# EAGLE design senseBox-OLED_v21 (EAGLE 7.7.0)
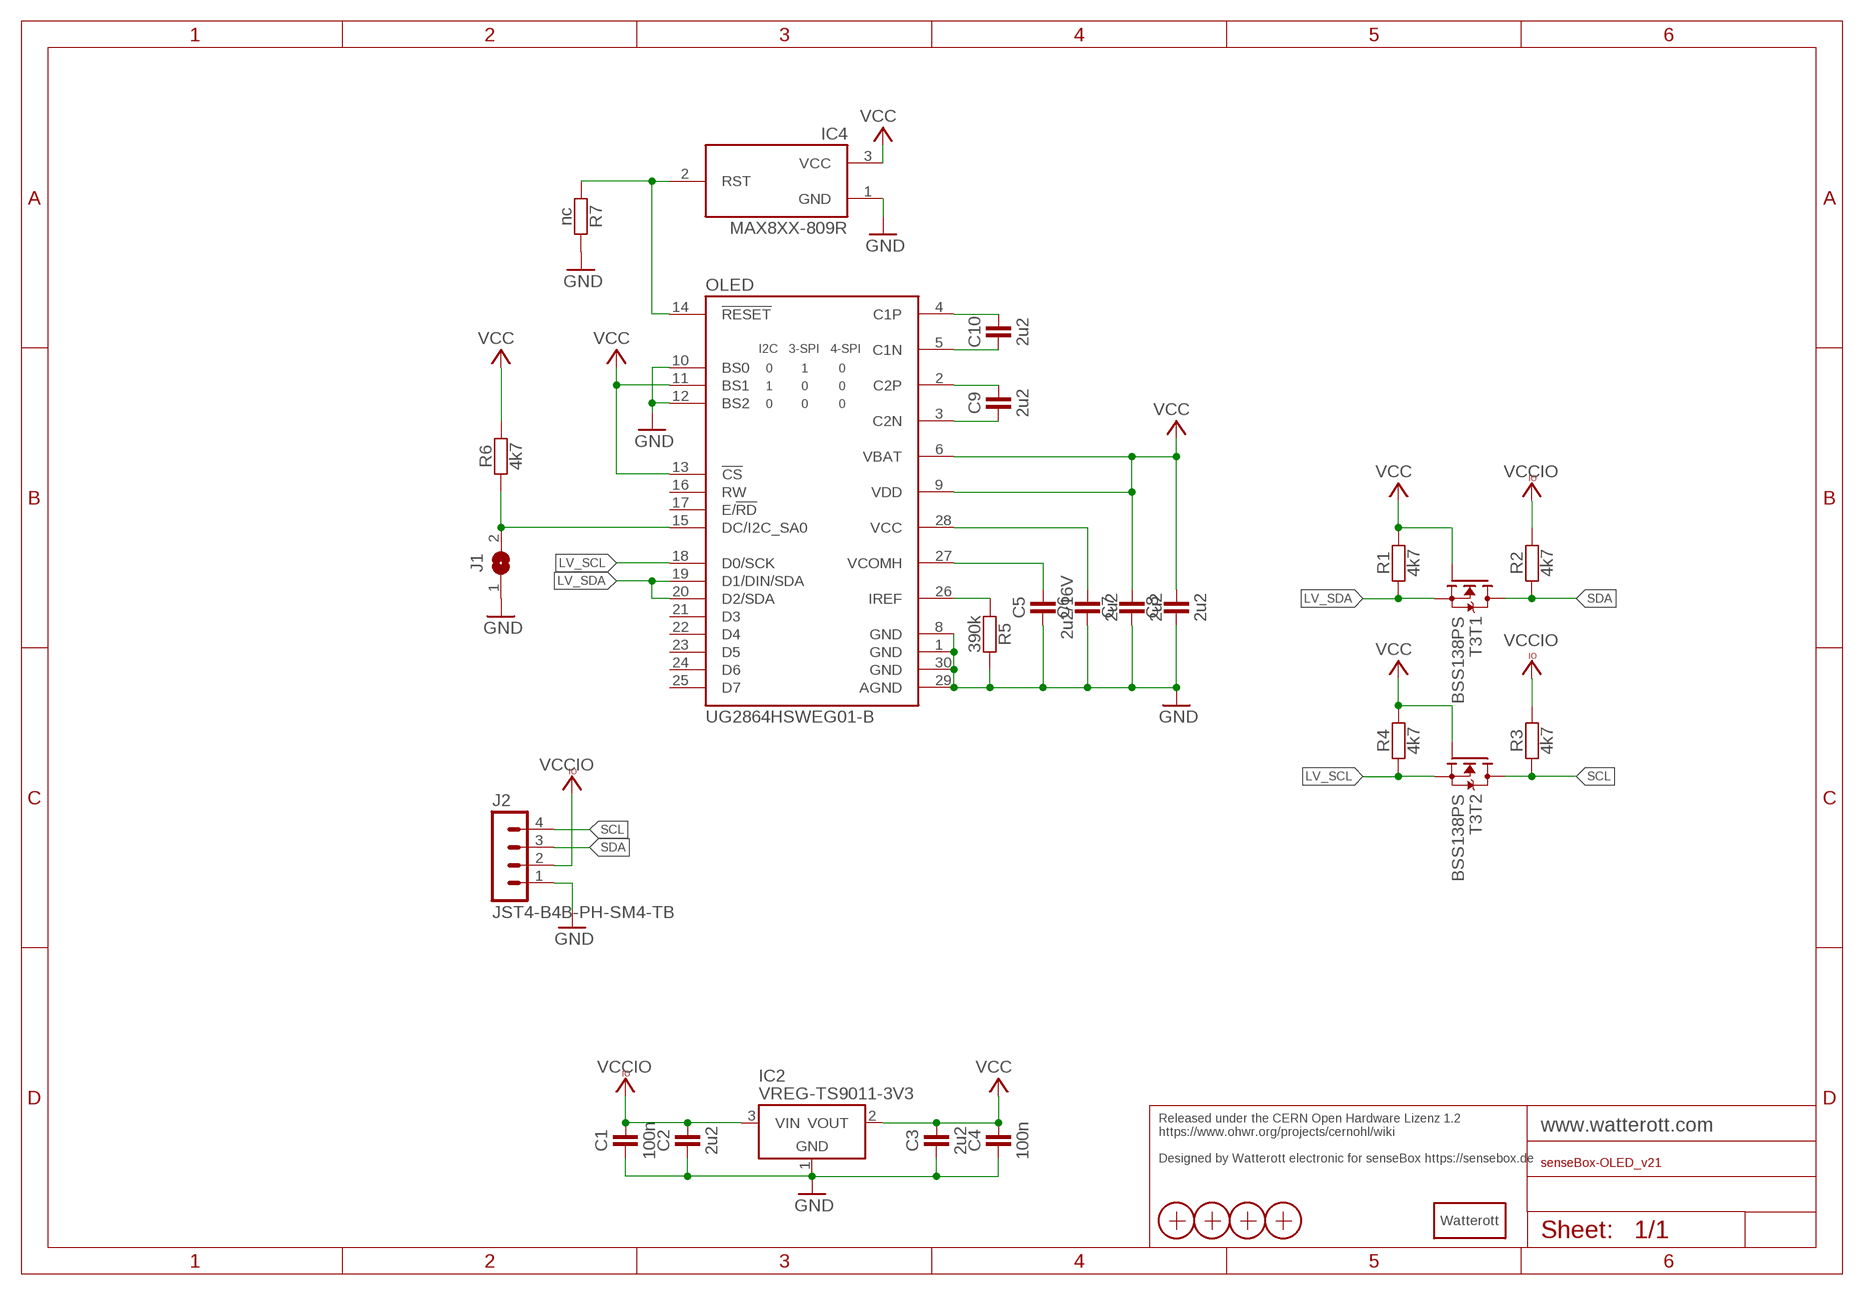
[diagram p0: schematic, sheet 1]

## Parts
C1  100n  CAPACITOR-0402  [C0402]
C2  2u2  CAPACITOR-0402  [C0402]
C3  2u2  CAPACITOR-0402  [C0402]
C4  100n  CAPACITOR-0402  [C0402]
C5  2u2/16V  CAPACITOR-0402  [C0402]
C6  2u2  CAPACITOR-0402  [C0402]
C7  2u2  CAPACITOR-0402  [C0402]
C8  2u2  CAPACITOR-0402  [C0402]
C9  2u2  CAPACITOR-0402  [C0402]
C10  2u2  CAPACITOR-0402  [C0402]
IC2  VREG-TS9011-3V3  [SOT23]
IC4  MAX8XX-809R  [SOT23]
J1  JUMPER2-0402-NC  [JUMPER2-0402_NC]
J2  JST4-B4B-PH-SM4-TB  [JST_B4B-PH-SM4-TB]
LOGO1  LOGO_SPARK-2  [SPARK_2MM]
OLED  UG2864HSWEG01-B  [UG2864HSWEG01_BOT]
R1  4k7  RESISTOR-0402  [C0402]
R2  4k7  RESISTOR-0402  [C0402]
R3  4k7  RESISTOR-0402  [C0402]
R4  4k7  RESISTOR-0402  [C0402]
R5  390k  RESISTOR-0402  [C0402]
R6  4k7  RESISTOR-0402  [C0402]
R7  nc  RESISTOR-0402  [C0402]
T3  BSS138PS  [SOT363]
X1  PASSER-07  [PASSER_07MM]
X2  PASSER-07  [PASSER_07MM]
X3  PASSER-07  [PASSER_07MM]
X4  PASSER-07  [PASSER_07MM]

## Nets
C1N: C10.1 OLED.5(C1N)
C1P: C10.2 OLED.4(C1P)
C2N: C9.1 OLED.3(C2N)
C2P: C9.2 OLED.2(C2P)
GND: C1.1 C2.1 C3.1 C4.1 C5.1 C6.1 C7.1 C8.1 IC2.1(GND) IC4.1(GND) J1.1 J2.1 OLED.1(GND) OLED.8(GND) OLED.10(BS0) OLED.12(BS2) OLED.29(AGND) OLED.30(GND) R5.2 R7.2
IREF: OLED.26(IREF) R5.1
LV_SCL: OLED.18(D0/SCK) R4.1 T3.4(T2:S)
LV_SDA: OLED.19(D1/DIN/SDA) OLED.20(D2/SDA) R1.1 T3.1(T1:S)
RST: IC4.2(RST) OLED.14(!RESET) R7.1
SA0: J1.2 OLED.15(DC/I2C_SA0) R6.1
SCL: J2.4 R3.1 T3.3(T2:D)
SDA: J2.3 R2.1 T3.6(T1:D)
VC: C6.2 OLED.28(VCC)
VCC: C3.2 C4.2 C7.2 C8.2 IC2.2(VOUT) IC4.3(VCC) OLED.6(VBAT) OLED.9(VDD) OLED.11(BS1) OLED.13(!CS) R1.2 R4.2 R6.2 T3.2(T1:G) T3.5(T2:G)
VCCIO: C1.2 C2.2 IC2.3(VIN) J2.2 R2.2 R3.2
VCH: C5.2 OLED.27(VCOMH)
Unconnected: OLED.16(RW) OLED.17(E/!RD) OLED.21(D3) OLED.22(D4) OLED.23(D5) OLED.24(D6) OLED.25(D7)

## Notes on the sheet
- Released under the CERN Open Hardware Lizenz 1.2
  https://www.ohwr.org/projects/cernohl/wiki
  
  Designed by Watterott electronic for senseBox https://sensebox.de

## Library data of the parts
C1-C10 = we-rcl:CAPACITOR: Capacitors ...2.2uF @ 6.3V -> 0402 ...4.7uF @ 6.3V -> 0603 ...10uF @ 16V -> 0805 ...22uF @ 25V -> 1206
IC2 = we-power:VREG: Voltage Regulators (LDOs, Switching Converters...) LDOs Taiwan Semi TS1117 800mA max 15V - compatible On Semi NCP1117 1A max 20V - compatible Diodes AP2111H 0.6A max 6V (0.25V@0.6A) - compatible Diodes AP2114H 1A max 6V (0.45V@1A) Taiwan Semi TS9011 250mA max 12V - compatible Diodes AP2210 300mA max 15V - compatible Microchip MCP1700 250mA max 6.5V - compatible Microchip MCP1702 250mA max 13V - compatible Microchip MCP1703 250mA max 16V - compatible Microchip MCP1754 150mA max 16V Taiwan Semi TS5204 80mA max 16V (low noise) DC/DC Converter Modules Recom R-78Ex.x-1.0-W36 1A max 28V - compatible CUI V78xx-2000 2A max 18V Murata OKI-78SR-x.x/1.5-W36 1.5A max 36V
IC4 = we-chip:MAX8XX: MAX8xx / STM8xx / TCM8xx Reset Monitor Reset Time: mind. 140ms, typ. 320ms, max. 560ms 803 - Active-Low, Open-Drain 809 - Active-Low, Push-Pull 810 - Active-High, Push-Pull ...Z - 2.3V ...R - 2.6V ...S - 2.9V ...T - 3.1V ...J - 4.0V ...M - 4.4V ...L - 4.6V
J1 = we-rcl:JUMPER2: 2 Pin Jumpers
J2 = we-con:JST4: JST Connector
LOGO1 = we-symbol:LOGO_SPARK: Watterott electronic Logo
OLED = we-opto:UG2864HSWEG01: Univision/WiseChip UG-2864HSWEG01 0.9" OLED (128x64) with SSD1306
R1-R7 = we-rcl:RESISTOR: Resistors all kinds in 0402 and 0603
T3 = we-transistor:BSS138PS: Dual N-Channel MOSFET BSS138 (Vgs>=+/-20V, Vds>=40V, Id>=0.2A + Rds<=3Ohm @ Vgs=4.5V)
X1-X4 = we-symbol:PASSER: Fiducial Markers

## Board
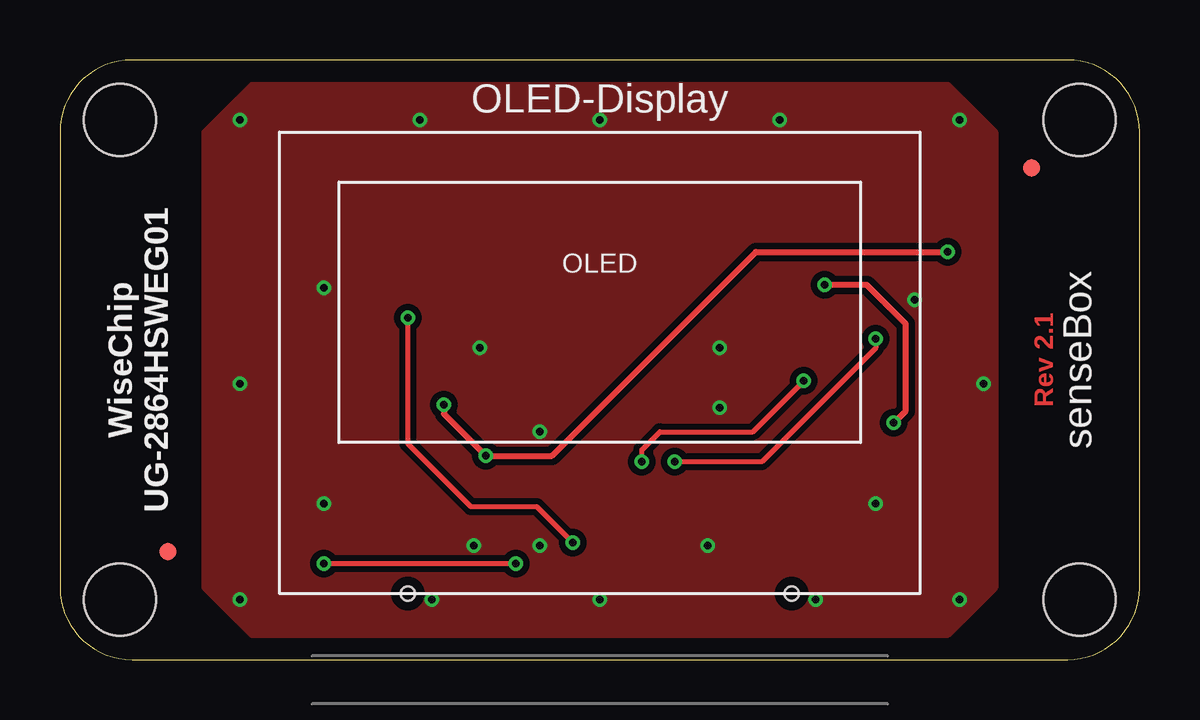
[diagram p1: board, top side]
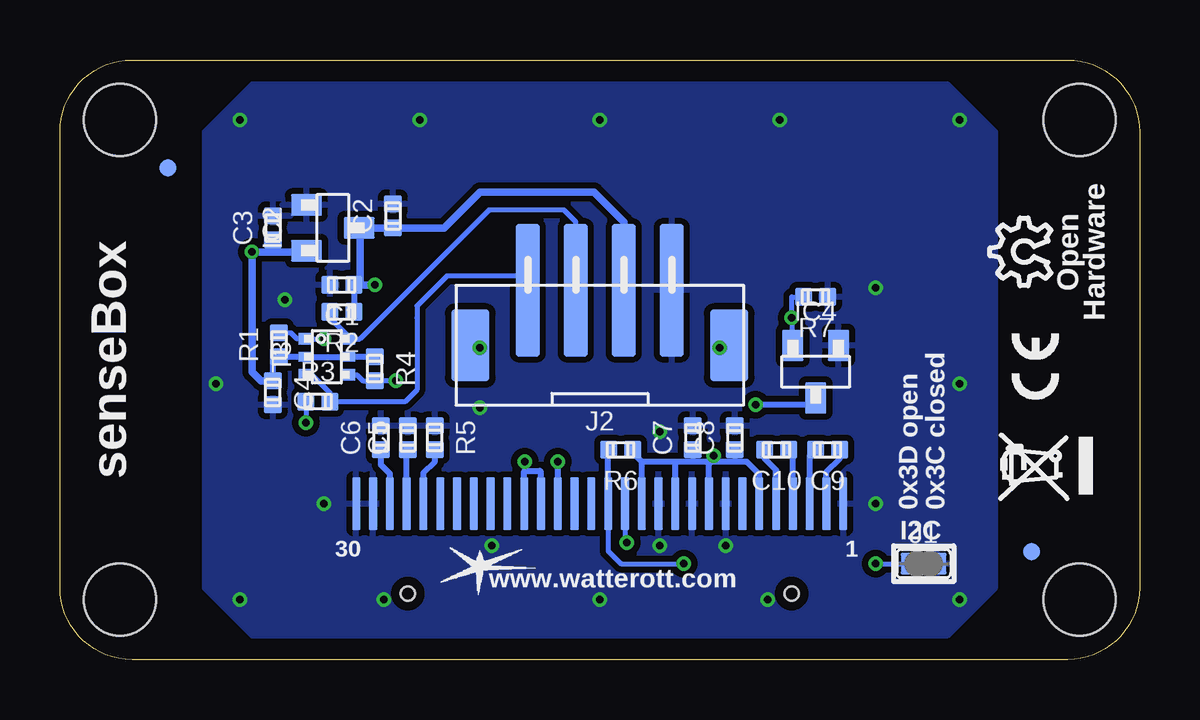
[diagram p2: board, bottom side, seen from below]

Size 45 x 25 mm. Coordinates in mm from the lower left corner, seen from the top.
Outline: 3,0 42,0 arc90 45,3 45,22 arc90 42,25 3,25 arc90 0,22 0,3 arc90 3,0
Copper layers (1*16): Top 0.035mm / dielectric 1.5mm / Bottom 0.035mm
Design rules "we-dru-2-layer": minimum track width 0.15mm, minimum drill 0.3mm, track to track 0.15mm, track to pad 0.15mm, pad to pad 0.15mm, via to via 0.15mm, smd to smd 0.1mm, copper to edge 0.4mm, drill to drill 0.2mm, minimum pad ring 0.18mm, minimum via ring 0.16mm, stop-mask expansion 0.1mm, vias tented up to drill 0.5mm, thermal gap 0.25mm
Holes 3 mm at 2.5,22.5 2.5,2.5 42.5,22.5 42.5,2.5

### Footprints (pad centres in the part's own frame; a part is rotated, then mirrored left to right if it is on the bottom)
C0402 = smd 0.75 x 0.7: 1 0,0.5; 2 0,-0.5
SOT23 = smd 1.3 x 0.9: 1 -1.1,0.95; 2 -1.1,-0.95; 3 1.1,0
JUMPER2-0402_NC = smd 0.9 x 0.8: 1 0,0.55; 2 0,-0.55
JST_B4B-PH-SM4-TB = smd 5.5 x 1: 1 -2.9,3; 2 -2.9,1; 3 -2.9,-1; 4 -2.9,-3 | smd 3 x 1.6: SHLD1 -0.6,5.4; SHLD2 -0.6,-5.4
UG2864HSWEG01_BOT = smd 0.35 x 2.2 bottom: 1 -10.15,3.75; 2 -9.45,3.75; 3 -8.75,3.75; 4 -8.05,3.75; 5 -7.35,3.75; 6 -6.65,3.75; 7 -5.95,3.75; 8 -5.25,3.75; 9 -4.55,3.75; 10 -3.85,3.75; 11 -3.15,3.75; 12 -2.45,3.75; 13 -1.75,3.75; 14 -1.05,3.75; 15 -0.35,3.75; 16 0.35,3.75; 17 1.05,3.75; 18 1.75,3.75; 19 2.45,3.75; 20 3.15,3.75; 21 3.85,3.75; 22 4.55,3.75; 23 5.25,3.75; 24 5.95,3.75; 25 6.65,3.75; 26 7.35,3.75; 27 8.05,3.75; 28 8.75,3.75; 29 9.45,3.75; 30 10.15,3.75 | hole 0.6: -8,0; 8,0
SOT363 = smd 0.6 x 0.5: 1 -0.9,0.75; 3 -0.9,-0.75; 4 0.9,-0.75; 6 0.9,0.75 | smd 0.6 x 0.4: 2 -0.9,0; 5 0.9,0
PASSER_07MM = smd 0.7 x 0.7: X 0,0

### Placement (x,y rotation side)
C1  33.25,15.62 90 bottom
C2  31.12,18.5 0 bottom
C3  36.12,18 0 bottom
C4  36.12,11.12 180 bottom
C5  30.5,9.25 0 bottom
C6  31.62,9.25 0 bottom
C7  18.62,9.25 0 bottom
C8  16.88,9.25 0 bottom
C9  13,8.75 90 bottom
C10  15.12,8.75 90 bottom
IC2  33.62,18 0 bottom
IC4  13.5,12 270 bottom
J1  9,4 270 bottom
J2  22.5,12.5 270 bottom
LOGO1  27.5,3.88 0 bottom
OLED  22.5,2.75 0 top
R1  35.88,13.12 0 bottom
R2  33.25,14.5 90 bottom
R3  34.25,10.75 270 bottom
R4  31.88,12.12 180 bottom
R5  29.38,9.25 180 bottom
R6  21.62,8.75 90 bottom
R7  13.5,15.12 90 bottom
T3  33.88,12.62 0 bottom
X1  40.5,20.5 0 top
X2  4.5,4.5 0 top
X3  4.5,4.5 0 bottom
X4  40.5,20.5 0 bottom

### Tracks (layer width: path | path; a pad name or v marks a point on that pad's centre or on a via)
C1N
  Bottom 0.254: OLED.5 15.15,7.9 15.62,8.38 C10.1
C1P
  Bottom 0.254: OLED.4 14.45,8.57 C10.2
C2N
  Bottom 0.254: OLED.3 13.75,8.5 C9.1
C2P
  Bottom 0.254: OLED.2 13.05,7.83 12.5,8.38 C9.2
GND  (via drill 0.3)
  other vias: 7.5,22.5 7.5,2.5 37.5,22.5 37.5,2.5 17.25,4.75 20,4.75 20,9.5 34,6.5 35.62,15 15,22.5 30,22.5 22.5,22.5 22.5,2.5 38.5,11.5 7.5,11.5 11,6.5 17.5,13 27.5,13 11,15.5 27,4.75 27.5,10.5 15.5,2.5 31.5,2.5
  pour Top (isolate 0.254): 6,22 8,24 37,24 39,22 39,3 37,1 8,1 6,3
  pour Bottom (isolate 0.254): 6,22 8,24 37,24 39,22 39,3 37,1 8,1 6,3
IREF
  Bottom 0.254: OLED.26 29.85,7.78 29.38,8.25 R5.1
LV_SCL  (via drill 0.3)
  Top 0.203: v24.25,8.25 24.25,8.75 25,9.5 28.88,9.5 v31,11.62
  Bottom 0.203: T3.4 32.62,11.88 32.38,11.62 R4.1 v31,11.62
  Bottom 0.254: OLED.18 v24.25,8.25
LV_SDA  (via drill 0.3)
  Top 0.203: v34,13.38 34,13 29.25,8.25 v25.62,8.25
  Bottom 0.203: 25.65,7.85 25.62,7.88 | R1.1 35.38,13.62 35.12,13.38 T3.1 v34,13.38
  Bottom 0.254: OLED.20 25.65,7.85 | OLED.19 24.95,7.83 25,7.88 25.62,7.88 v25.62,8.25
RST  (via drill 0.3)
  Top 0.203: v21.38,4.88 19.88,6.38 17.12,6.38 14.5,9 v14.5,14.25
  Bottom 0.203: OLED.14 21.45,4.95 v21.38,4.88 | 14.5,13.15 v14.5,14.25 14.5,15.12 R7.1
  Bottom 0.254: 14.5,13.15 IC4.2
SA0  (via drill 0.3)
  Top 0.203: v19,4 v11,4
  Bottom 0.203: 22.15,8.72 R6.1 | OLED.15 22.15,4.53 21.62,4 v19,4 | v11,4 J1.2
  Bottom 0.254: OLED.15 22.15,8.72
SCL
  Bottom 0.203: T3.3 34.5,11.88 33.75,11.12 R3.1 30.62,10.75 30.12,11.25 30.12,14.25 30.12,14.75 28.88,16 28.38,16 25.5,16 J2.4
SDA
  Bottom 0.203: J2.3 23.5,18.25 24,18.75 27.12,18.75 32.5,13.38 T3.6 32.98,13.47 33.75,14.25 R2.1
VC
  Bottom 0.254: OLED.28 31.25,7.75 31.62,8.12 C6.2
VCC  (via drill 0.3)
  Top 0.254: v37,17 29,17 20.5,8.5 v17.75,8.5 16,10.25 v16,10.62
  Bottom 0.203: C8.2 16.88,8.25 | C7.2 18.62,8.25 | 36.12,12.38 R1.2 | 36.12,17 v37,17
  Bottom 0.254: OLED.6 15.85,7.72 16.38,8.25 16.88,8.25 17.75,8.25 | 17.75,8.25 17.88,8.25 | 17.88,8.25 18.62,8.25 19.38,8.25 | 19.38,8.25 20.75,8.25 | OLED.9 17.95,8.18 17.88,8.25 | OLED.13 20.75,8.25 | OLED.11 19.35,8.22 19.38,8.25 | R4.2 T3.5 T3.2 R1.2 | C4.2 36.12,12.38 | v17.75,8.5 17.75,8.25 | R6.2 21.12,8.62 20.75,8.25 | IC4.3 13.5,10.75 13.62,10.62 v16,10.62
  Bottom 0.305: C3.2 36.12,17 | IC2.2 34.77,17 v37,17 37,12 36.62,11.62 C4.2
VCCIO  (via drill 0.3)
  Top 0.254: v34.75,9.88 35.25,10.38 35.25,14 33.62,15.62 v31.88,15.62
  Bottom 0.203: 32.5,17.98 IC2.3 | R3.2 v34.75,9.88
  Bottom 0.254: R2.2 C1.2 32.5,15.62
  Bottom 0.305: IC2.3 C2.2 29,18 27.5,19.5 22.75,19.5 21.5,18.25 J2.2 | 32.5,17.98 32.5,15.62 v31.88,15.62
VCH
  Bottom 0.254: OLED.27 30.55,8.7 C5.2

### Text on the board
Top: Rev 2.1
tPlace: OLED-Display | WiseChip / UG-2864HSWEG01 | senseBox
bPlace: Hardware | Open | senseBox | 0x3C closed | 0x3D open | I2C | 1 | 30 | www.watterott.com
Reference: Silkscreen: 21 tPlace + 22 bPlace